# Altium project FLYBACK_SWITCHING_POWER_SUPPLY.PrjPcb
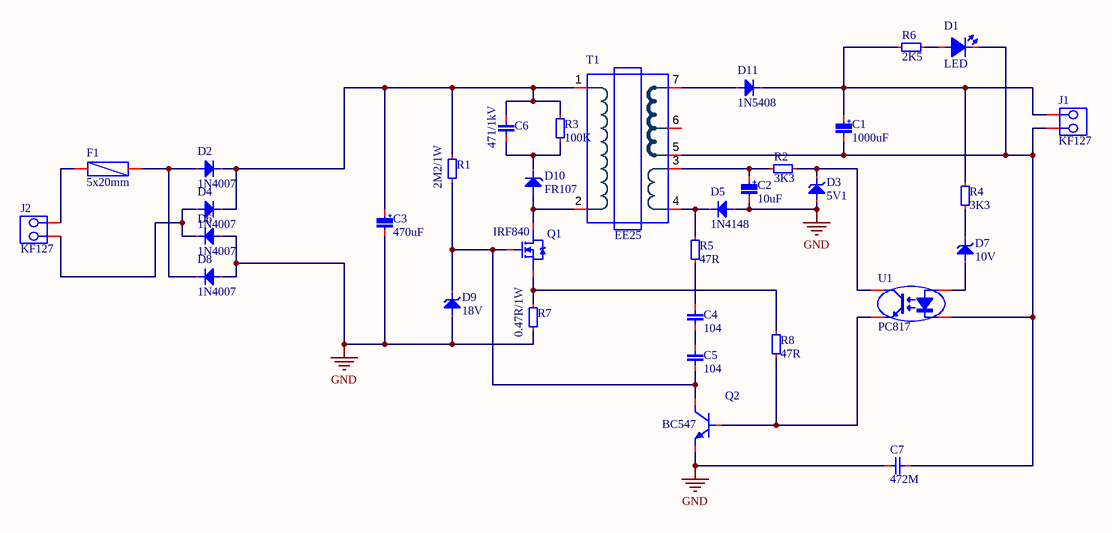
[diagram p0: FLYBACK_SWITCHING_POWER_SUPPLY.SchDoc]
1 sheet, 33 parts. Net scope: global (net labels, ports and power ports of the same name join across sheets).
Board files: FLYBACK_SWITCHING_POWER_SUPPLY.PcbDoc, PCB1.PcbDoc

## Sheet FLYBACK_SWITCHING_POWER_SUPPLY.SchDoc
size A4; SheetNumber: 1; SheetTotal: 1

### Parts
C1  1000uF  [CAP_RAD_D12.5x15]
C2  10uF  [CAP_RAD_D05x11]
C3  470uF  [CAP_RAD_D12.5x15]
C4  104  [CAP_Ceramic_2.5MM]
C5  104  [CAP_Ceramic_2.5MM]
C6  471/1kV  [CAP_Ceramic_5MM]
C7  472M  [CAP_Ceramic_472M_7.21MM]
D1  LED  [LED_3MM_GREEN]
D2  1N4007  [DO-204AL-BK]
D3  5V1  [DO-204AL-RD]
D4  1N4007  [DO-204AL-BK]
D5  1N4148  [DO-204AH-RD]
D6  1N4007  [DO-204AL-BK]
D7  10V  [DO-204AL-RD]
D8  1N4007  [DO-204AL-BK]
D9  18V  [DO-204AL-RD]
D10  FR107  [DO-204AL-BK]
D11  1N5408  [DO-201AD-BK]
F1  5x20mm  [FUSE_Bel_MJS]
J1  KF127  [DG127-5.0-02P-14-00AH]
J2  KF127  [DG127-5.0-02P-14-00AH]
Q1  IRF840  [TO-220-HEAT-SINK-1]
Q2  BC547  [TO-92]
R1  2M2/1W  [RES-1W-H]
R2  3K3  [RES-0.25W-H]
R3  100K  [RES-0.5W-H]
R4  3K3  [RES-0.25W-H]
R5  47R  [RES-0.25W-H]
R6  2K5  [RES-0.25W-H]
R7  0.47R/1W  [RES-2W-H]
R8  47R  [RES-0.25W-H]
T1  EE25  [TRANSFORMER-FLUOLAMP-8W]
U1  PC817  [PC817-DIP]

### Nets
GND: C2.2 C3.2 C7.1 D3.1 D5.1 D6.1 D8.1 D9.1 Q2.3(E) R7.1
NetC1_1: C1.1 D11.2 J1.1 R4.2 R6.1
NetC1_2: C1.2 C7.2 D1.2(K) J1.2 T1.5 U1.2(K)
NetC2_1: C2.1 R2.2 T1.3
NetC3_1: C3.1 C6.2 D2.2 D4.2 R1.2 R3.2 T1.1
NetC4_1: C4.1 C5.2
NetC4_2: C4.2 R5.1
NetC5_1: C5.1 D9.2 Q1.1(G) Q2.1(C) R1.1
NetC6_1: C6.1 D10.2 R3.1
NetD1_1: D1.1(A) R6.2
NetD2_1: D2.1 D8.2 F1.2
NetD3_2: D3.2 R2.1 U1.4(C)
NetD4_1: D4.1 D6.2 J2.1
NetD5_2: D5.2 R5.2 T1.4
NetD7_1: D7.1 U1.1(A)
NetD7_2: D7.2 R4.1
NetD10_1: D10.1 Q1.2(D) T1.2
NetD11_1: D11.1 T1.7
NetF1_1: F1.1 J2.2
NetQ1_3: Q1.3(S) R7.2 R8.2
NetQ2_2: Q2.2(B) R8.1 U1.3(E)

Not connected (* = marked no-connect by the designer): T1 6

### Notes on the sheet
- (in symbol Capacitor(Radian)) +

### Library data of the parts
C1-C3 = Capacitor(Radian)
C4-C7 = Capacitors(Disc)
D1 = LED 3MM
D2 D4 D6 D8 = Diode-1N4007
D3 D7 D9 = Diode-Zener
D5 = Diode-1N4148
D10 = Diode-FR107: 1A 1000V
D11 = Diode-1N5401
F1 = Fuse-5x20mm
J1 J2 = DG127-5.0-02P-14-00AH
Q1 = Mosfet-IRF840
Q2 = Transistor-BC547: VCEO: 45 Vdc / VCBO: 50 Vdc / VEBO: 6.0 Vdc
R1-R8 = Resistors THD
T1 = TRANS-FLUOLAMP-V0
U1 = Opto-PC817